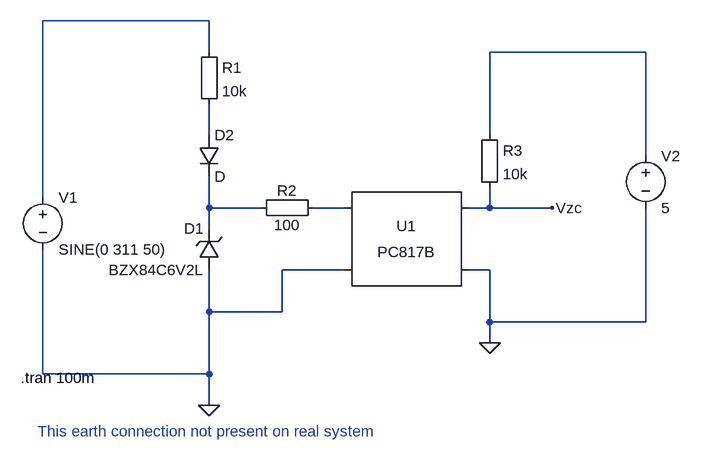
[diagram p0: schematic zcd4.asc]
zcd4.asc, the LTspice schematic file:
Version 4
SHEET 1 880 680
WIRE 32 -160 -224 -160
WIRE 32 -112 32 -160
WIRE 704 -112 464 -112
WIRE 32 16 32 -32
WIRE 464 16 464 -112
WIRE 704 48 704 -112
WIRE -224 112 -224 -160
WIRE 32 128 32 80
WIRE 112 128 32 128
WIRE 240 128 192 128
WIRE 464 128 464 96
WIRE 464 128 432 128
WIRE 560 128 464 128
WIRE 32 160 32 128
WIRE 240 224 144 224
WIRE 464 224 432 224
WIRE 32 288 32 224
WIRE 144 288 144 224
WIRE 144 288 32 288
WIRE 464 304 464 224
WIRE 704 304 704 128
WIRE 704 304 464 304
WIRE 464 336 464 304
WIRE -224 384 -224 192
WIRE 32 384 32 288
WIRE 32 384 -224 384
WIRE 32 432 32 384
FLAG 464 336 0
FLAG 32 432 0
FLAG 560 128 Vzc
SYMBOL Optos\\PC817B 336 176 R0
SYMATTR InstName U1
SYMBOL diode 16 16 R0
SYMATTR InstName D2
SYMBOL voltage -224 96 R0
WINDOW 123 0 0 Left 0
WINDOW 39 0 0 Left 0
SYMATTR InstName V1
SYMATTR Value SINE(0 311 50)
SYMBOL zener 48 224 R180
WINDOW 0 24 64 Left 2
WINDOW 3 24 0 Left 2
SYMATTR InstName D1
SYMATTR Value BZX84C6V2L
SYMATTR Description Diode
SYMATTR Type diode
SYMBOL Misc\\EuropeanResistor 16 -128 R0
SYMATTR InstName R1
SYMATTR Value 10k
SYMBOL Misc\\EuropeanResistor 208 112 R90
WINDOW 0 5 56 VBottom 2
WINDOW 3 27 56 VTop 2
SYMATTR InstName R2
SYMATTR Value 100
SYMBOL Misc\\EuropeanResistor 448 0 R0
SYMATTR InstName R3
SYMATTR Value 10k
SYMBOL voltage 704 32 R0
WINDOW 123 0 0 Left 0
WINDOW 39 0 0 Left 0
SYMATTR InstName V2
SYMATTR Value 5
TEXT -258 390 Left 2 !.tran 100m
TEXT -232 472 Left 2 ;This earth connection not present on real system

The netlist it stands for:
* zcd4.asc
XU1 N005 0 Vzc 0 PC817 Igain=1.5m
D2 N003 N004 D
V1 N001 0 SINE(0 311 50)
D1 0 N004 BZX84C6V2L
R1 N001 N003 10k
R2 N005 N004 100
R3 N002 Vzc 10k
V2 N002 0 5
.model D D
.lib standard.dio
.tran 100m
* This earth connection not present on real system
.lib PC817.sub
.backanno
.end